# EAGLE schematic Project-H10 (EAGLE 9.6.2)
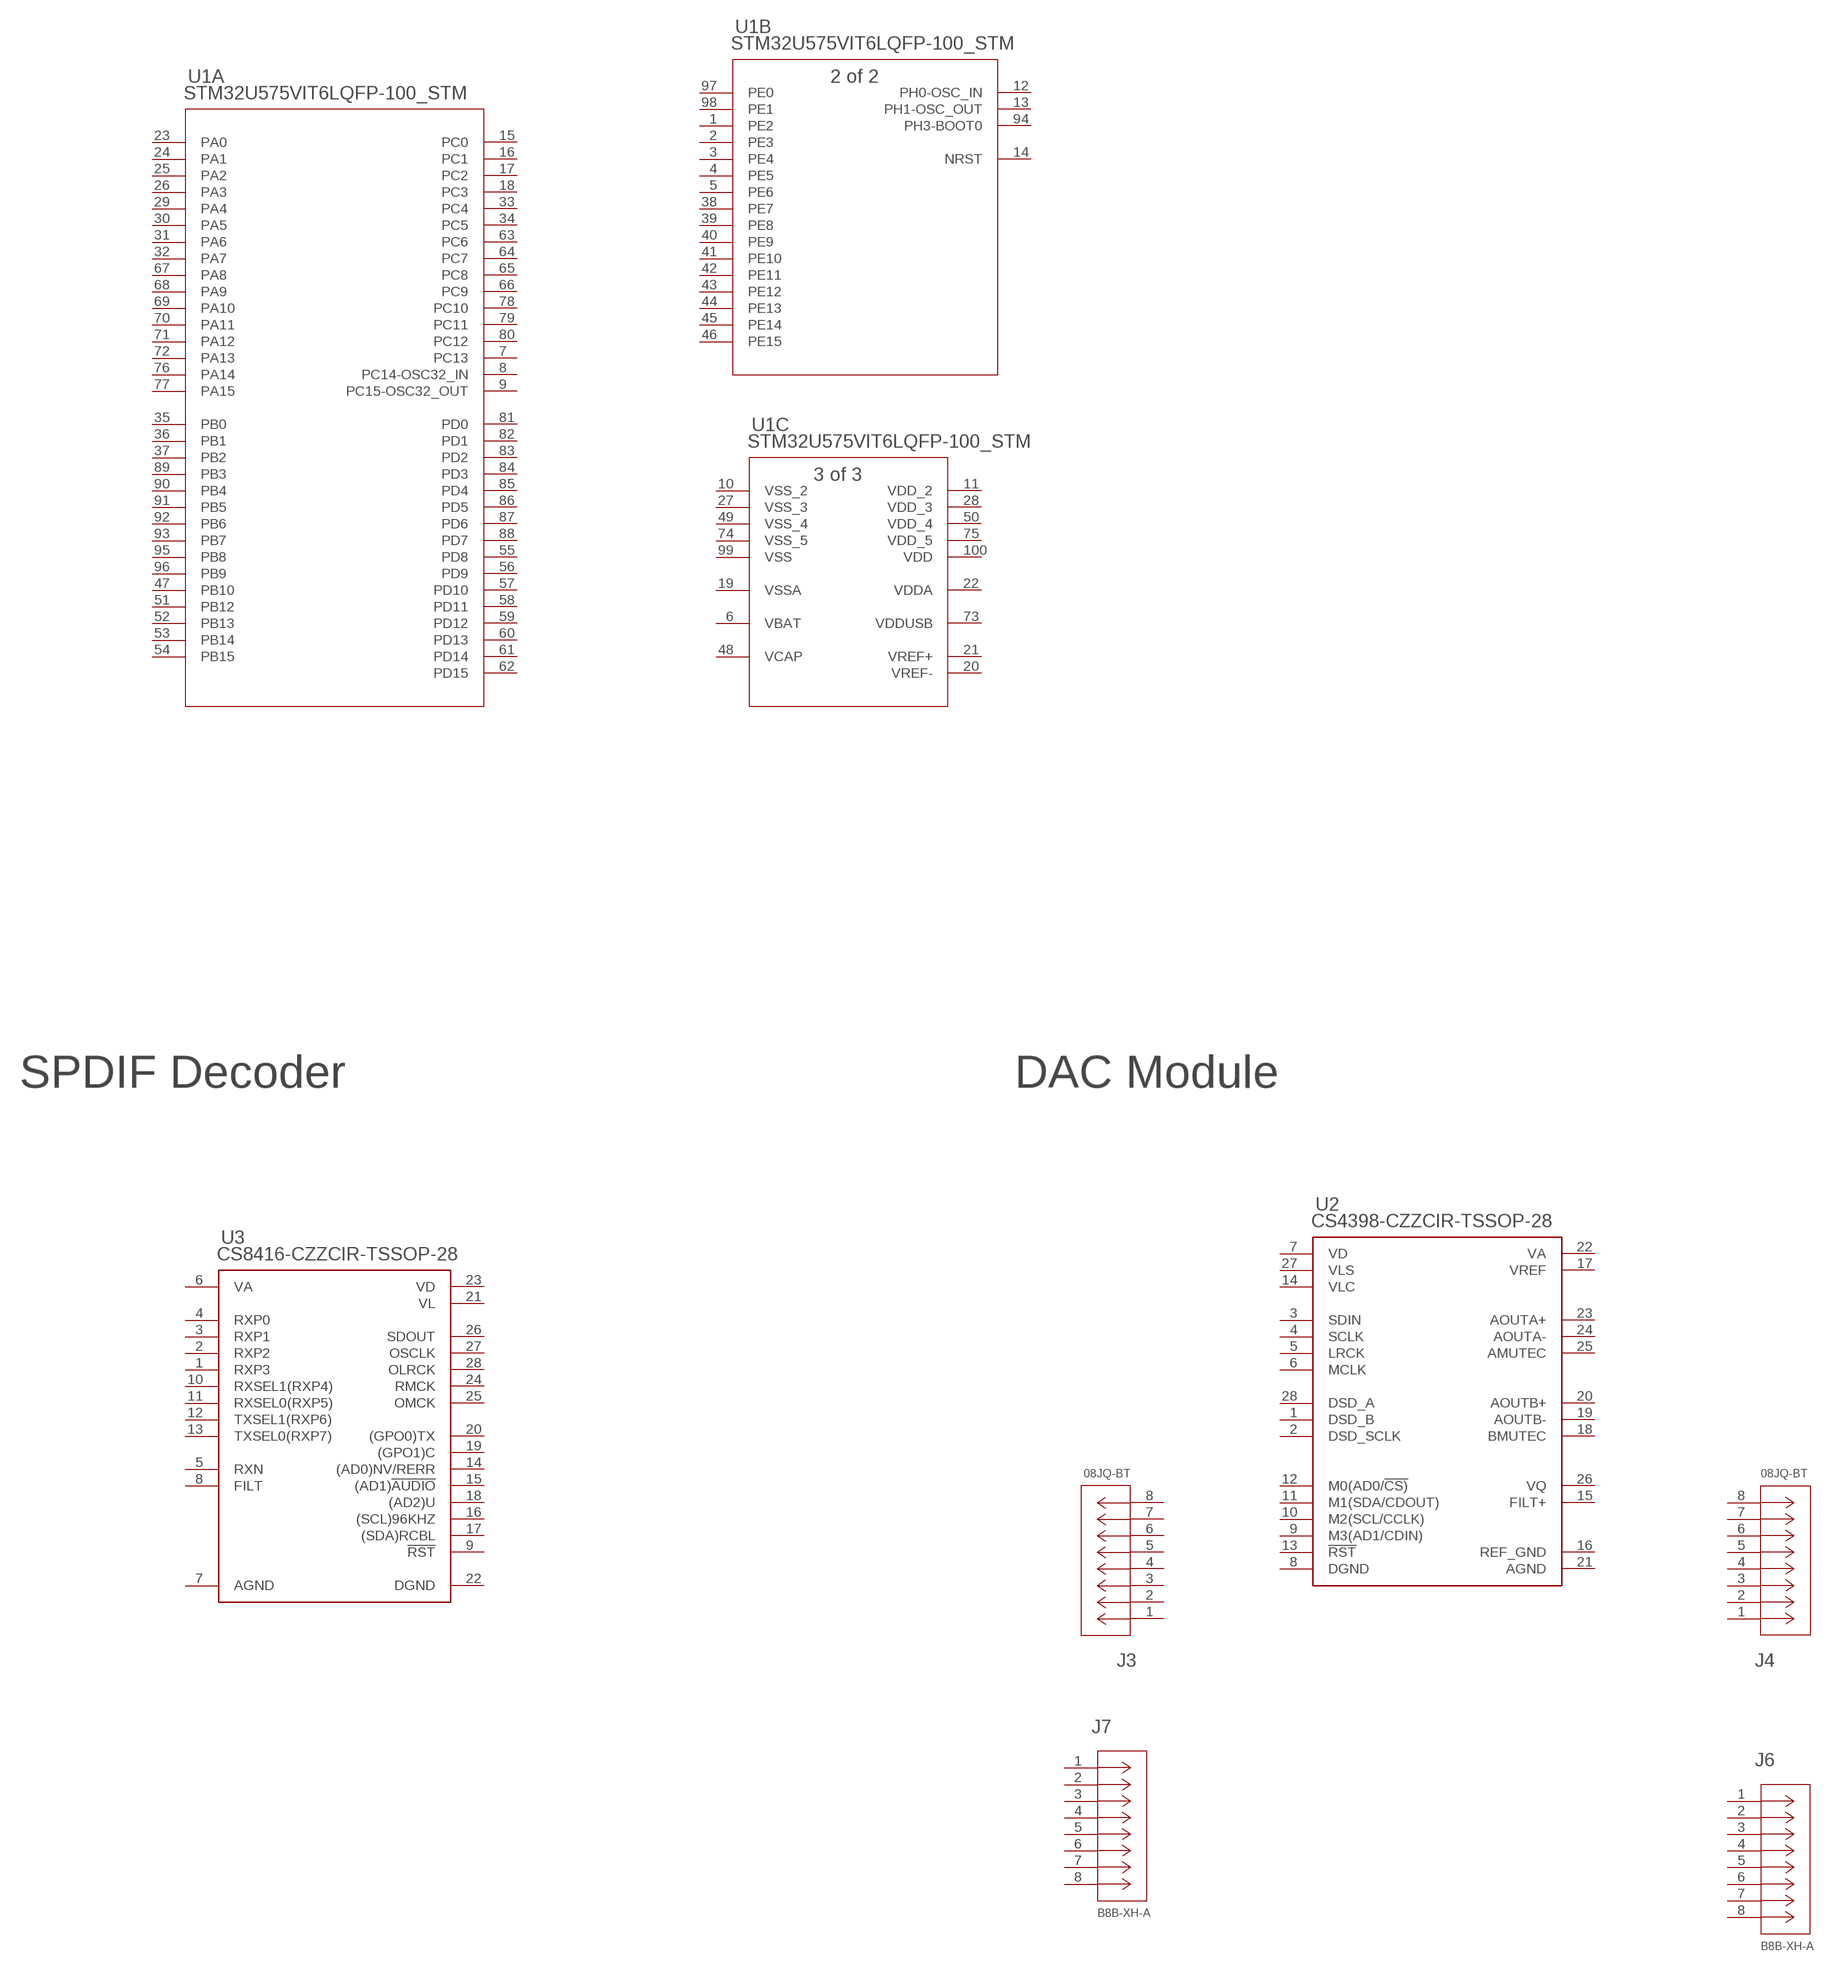
[diagram p0: schematic, sheet 1, part 1 of 2]
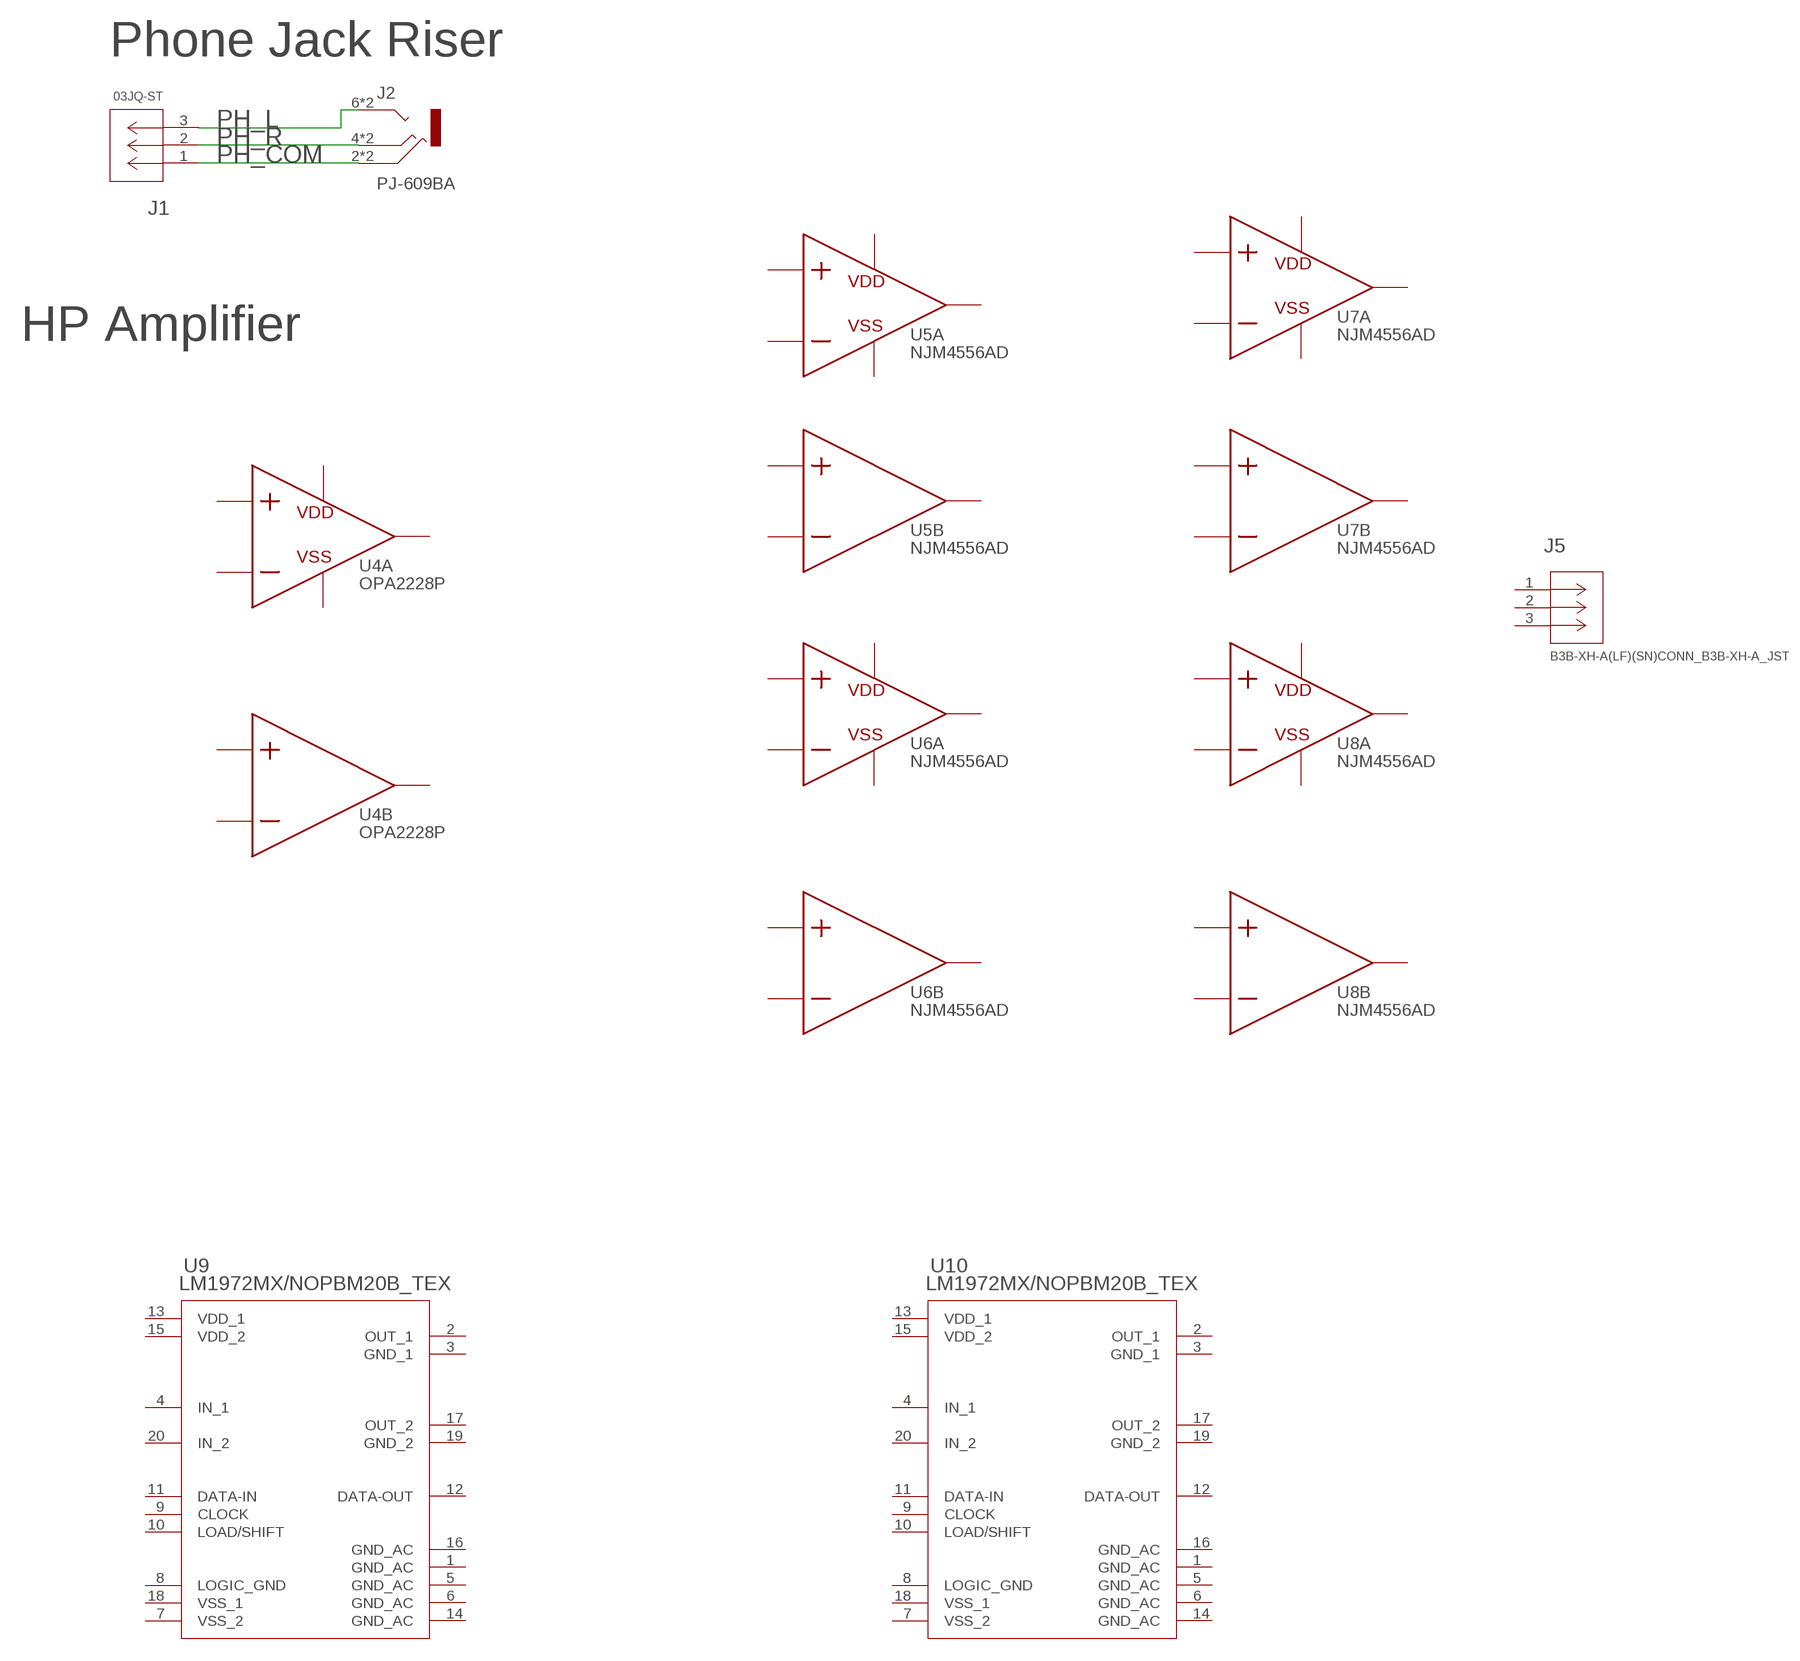
[diagram p1: schematic, sheet 1, part 2 of 2]

## Parts
J1  03JQ-ST  03JQ-STCONN_03JQ-ST_JST  [CONN_03JQ-ST_JST]
J2  PJ-609BA  [PJ-609BA]
J3  08JQ-BT  [08JQ-BT_JST]
J4  08JQ-BT  [08JQ-BT_JST]
J5  B3B-XH-A(LF)(SN)CONN_B3B-XH-A_JST  [CONN_B3B-XH-A_JST]
J6  B8B-XH-A  B8B-XH-A_(LF)(SN)CONN_B8B-XH-A_JST  [CONN_B8B-XH-A_JST]
J7  B8B-XH-A  B8B-XH-A_(LF)(SN)CONN_B8B-XH-A_JST  [CONN_B8B-XH-A_JST]
U1  STM32U575VIT6LQFP-100_STM  [LQFP-100_STM]
U2  CS4398-CZZCIR-TSSOP-28  [CIR-TSSOP-28]
U3  CS8416-CZZCIR-TSSOP-28  [CIR-TSSOP-28]
U4  OPA2228P  OPAMP2  [P8]
U5  NJM4556AD  OPAMP2  [P8]
U6  NJM4556AD  OPAMP2  [P8]
U7  NJM4556AD  OPAMP2  [P8]
U8  NJM4556AD  OPAMP2  [P8]
U9  LM1972MX/NOPBM20B_TEX  [M20B_TEX]
U10  LM1972MX/NOPBM20B_TEX  [M20B_TEX]

## Nets
PH_COM: J1.1 J2.2 J2.3
PH_L: J1.3 J2.6 J2.7
PH_R: J1.2 J2.4 J2.5
Unconnected: J3.1 J3.2 J3.3 J3.4 J3.5 J3.6 J3.7 J3.8 J4.1 J4.2 J4.3 J4.4 J4.5 J4.6 J4.7 J4.8 J5.1 J5.2 J5.3 J6.1 J6.2 J6.3 J6.4 J6.5 J6.6 J6.7 J6.8 J7.1 J7.2 J7.3 J7.4 J7.5 J7.6 J7.7 J7.8 U1.1(B:PE2) U1.2(B:PE3) U1.3(B:PE4) U1.4(B:PE5) U1.5(B:PE6) U1.7(A:PC13) U1.8(A:PC14-OSC32_IN) U1.9(A:PC15-OSC32_OUT) U1.12(B:PH0-OSC_IN) U1.13(B:PH1-OSC_OUT) U1.14(B:NRST) U1.15(A:PC0) U1.16(A:PC1) U1.17(A:PC2) U1.18(A:PC3) U1.23(A:PA0) U1.24(A:PA1) U1.25(A:PA2) U1.26(A:PA3) U1.29(A:PA4) U1.30(A:PA5) U1.31(A:PA6) U1.32(A:PA7) U1.33(A:PC4) U1.34(A:PC5) U1.35(A:PB0) U1.36(A:PB1) U1.37(A:PB2) U1.38(B:PE7) U1.39(B:PE8) U1.40(B:PE9) U1.41(B:PE10) U1.42(B:PE11) U1.43(B:PE12) U1.44(B:PE13) U1.45(B:PE14) U1.46(B:PE15) U1.47(A:PB10) U1.51(A:PB12) U1.52(A:PB13) U1.53(A:PB14) U1.54(A:PB15) U1.55(A:PD8) U1.56(A:PD9) U1.57(A:PD10) U1.58(A:PD11) U1.59(A:PD12) U1.60(A:PD13) U1.61(A:PD14) U1.62(A:PD15) U1.63(A:PC6) U1.64(A:PC7) U1.65(A:PC8) U1.66(A:PC9) U1.67(A:PA8) U1.68(A:PA9) U1.69(A:PA10) U1.70(A:PA11) U1.71(A:PA12) U1.72(A:PA13) U1.76(A:PA14) U1.77(A:PA15) U1.78(A:PC10) U1.79(A:PC11) U1.80(A:PC12) U1.81(A:PD0) U1.82(A:PD1) U1.83(A:PD2) U1.84(A:PD3) U1.85(A:PD4) U1.86(A:PD5) U1.87(A:PD6) U1.88(A:PD7) U1.89(A:PB3) U1.90(A:PB4) U1.91(A:PB5) U1.92(A:PB6) U1.93(A:PB7) U1.94(B:PH3-BOOT0) U1.95(A:PB8) U1.96(A:PB9) U1.97(B:PE0) U1.98(B:PE1) U2.1(DSD_B) U2.2(DSD_SCLK) U2.3(SDIN) U2.4(SCLK) U2.5(LRCK) U2.6(MCLK) U2.9(M3(AD1/CDIN)) U2.10(M2(SCL/CCLK)) U2.11(M1(SDA/CDOUT)) U2.12(M0(AD0/!CS)) U2.13(!RST) U2.15(FILT+) U2.17(VREF) U2.18(BMUTEC) U2.19(AOUTB-) U2.20(AOUTB+) U2.23(AOUTA+) U2.24(AOUTA-) U2.25(AMUTEC) U2.26(VQ) U2.28(DSD_A) U3.1(RXP3) U3.2(RXP2) U3.3(RXP1) U3.4(RXP0) U3.5(RXN) U3.8(FILT) U3.9(!RST) U3.10(RXSEL1(RXP4)) U3.11(RXSEL0(RXP5)) U3.12(TXSEL1(RXP6)) U3.13(TXSEL0(RXP7)) U3.14((AD0)NV/RERR) U3.15((AD1)!AUDIO) U3.16((SCL)96KHZ) U3.17((SDA)RCBL) U3.18((AD2)U) U3.19((GPO1)C) U3.20((GPO0)TX) U3.24(RMCK) U3.25(OMCK) U3.26(SDOUT) U3.27(OSCLK) U3.28(OLRCK) U4.1(A:VOUT) U4.2(A:N) U4.3(A:P) U4.5(B:P) U4.6(B:N) U4.7(B:VOUT) U5.1(A:VOUT) U5.2(A:N) U5.3(A:P) U5.5(B:P) U5.6(B:N) U5.7(B:VOUT) U6.1(A:VOUT) U6.2(A:N) U6.3(A:P) U6.5(B:P) U6.6(B:N) U6.7(B:VOUT) U7.1(A:VOUT) U7.2(A:N) U7.3(A:P) U7.5(B:P) U7.6(B:N) U7.7(B:VOUT) U8.1(A:VOUT) U8.2(A:N) U8.3(A:P) U8.5(B:P) U8.6(B:N) U8.7(B:VOUT) U9.2(OUT_1) U9.4(IN_1) U9.9(CLOCK) U9.10(LOAD/SHIFT) U9.11(DATA-IN) U9.12(DATA-OUT) U9.17(OUT_2) U9.20(IN_2) U10.2(OUT_1) U10.4(IN_1) U10.9(CLOCK) U10.10(LOAD/SHIFT) U10.11(DATA-IN) U10.12(DATA-OUT) U10.17(OUT_2) U10.20(IN_2)

## Notes on the sheet
- Phone Jack Riser
- HP Amplifier
- SPDIF Decoder | DAC Module

## Power pins joined to a net without a drawn wire
AGND: U2.21(AGND) U3.7(AGND)
DGND: U2.8(DGND) U3.22(DGND)
GND_1: U9.3(GND_1) U10.3(GND_1)
GND_2: U9.19(GND_2) U10.19(GND_2)
GND_AC: U9.1(GND_AC) U9.5(GND_AC) U9.6(GND_AC) U9.14(GND_AC) U9.16(GND_AC) U10.1(GND_AC) U10.5(GND_AC) U10.6(GND_AC) U10.14(GND_AC) U10.16(GND_AC)
LOGIC_GND: U9.8(LOGIC_GND) U10.8(LOGIC_GND)
REF_GND: U2.16(REF_GND)
VA: U2.22(VA) U3.6(VA)
VBAT: U1.6(C:VBAT)
VCAP: U1.48(C:VCAP)
VD: U2.7(VD) U3.23(VD)
VDD: U1.100(C:VDD) U4.8(A:VDD) U5.8(A:VDD) U6.8(A:VDD) U7.8(A:VDD) U8.8(A:VDD)
VDD_1: U9.13(VDD_1) U10.13(VDD_1)
VDD_2: U1.11(C:VDD_2) U9.15(VDD_2) U10.15(VDD_2)
VDD_3: U1.28(C:VDD_3)
VDD_4: U1.50(C:VDD_4)
VDD_5: U1.75(C:VDD_5)
VDDA: U1.22(C:VDDA)
VDDUSB: U1.73(C:VDDUSB)
VL: U3.21(VL)
VLC: U2.14(VLC)
VLS: U2.27(VLS)
VREF+: U1.21(C:VREF+)
VREF-: U1.20(C:VREF-)
VSS: U1.99(C:VSS) U4.4(A:VSS) U5.4(A:VSS) U6.4(A:VSS) U7.4(A:VSS) U8.4(A:VSS)
VSS_1: U9.18(VSS_1) U10.18(VSS_1)
VSS_2: U1.10(C:VSS_2) U9.7(VSS_2) U10.7(VSS_2)
VSS_3: U1.27(C:VSS_3)
VSS_4: U1.49(C:VSS_4)
VSS_5: U1.74(C:VSS_5)
VSSA: U1.19(C:VSSA)

## Library data of the parts
J1 = Project-H10:03JQ-ST; COPYRIGHT: Copyright (C) 2023 Ultra Librarian. All rights reserved.; MANUFACTURER_PART_NUMBER: 03JQ-ST; MFR_NAME: JST
J2 = Project-H10:PJ-609BA
J3 J4 = Project-H10:08JQ-
J5 = Project-H10:B3B-XH-A(LF)(SN); COPYRIGHT: Copyright (C) 2023 Ultra Librarian. All rights reserved.; MANUFACTURER_PART_NUMBER: B3B-XH-A(LF)(SN); MFR_NAME: JST
J6 J7 = Project-H10:B8B-XH-A_(LF)(SN); COPYRIGHT: Copyright (C) 2023 Ultra Librarian. All rights reserved.; MANUFACTURER_PART_NUMBER: B8B-XH-A (LF)(SN); MFR_NAME: JST
U1 = Project-H10:STM32U575VIT6; COPYRIGHT: Copyright (C) 2023 Ultra Librarian. All rights reserved.; MANUFACTURER_PART_NUMBER: STM32U575VIT6; MFR_NAME: STMicroelectronics
U2 = Project-H10:CS4398-CZZ; COPYRIGHT: Copyright (C) 2023 Ultra Librarian. All rights reserved.; MANUFACTURER_PART_NUMBER: CS4398-CZZ; MFR_NAME: Cirrus Logic
U3 = Project-H10:CS8416-CZZ; COPYRIGHT: Copyright (C) 2023 Ultra Librarian. All rights reserved.; MANUFACTURER_PART_NUMBER: CS8416-CZZ; MFR_NAME: Cirrus Logic
U4-U8 = Project-H10:OPAMP2
U9 U10 = Project-H10:LM1972MX/NOPB; COPYRIGHT: Copyright (C) 2023 Ultra Librarian. All rights reserved.; MANUFACTURER_PART_NUMBER: LM1972MX/NOPB; MFR_NAME: Texas Instruments